# Altium project wulpus_pro_shield.PrjPcb (part 1 of 2)
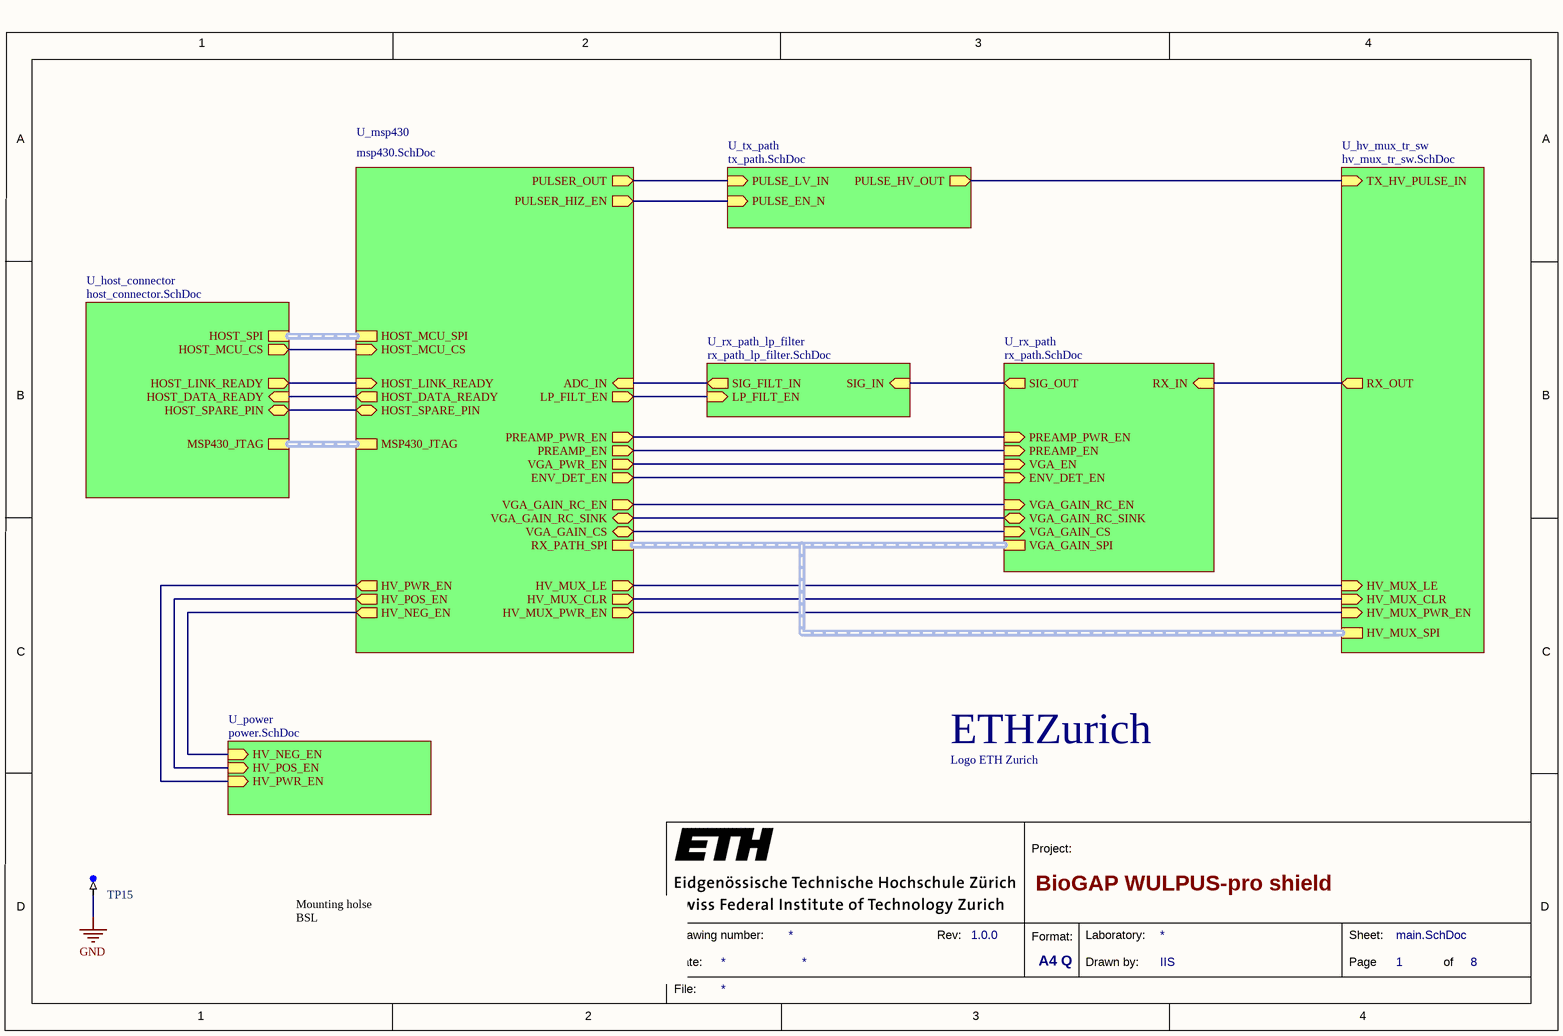
[diagram p0: main.SchDoc]
title: BioGAP WULPUS-pro shield
8 sheets, 187 parts. Net scope: hierarchical (ports join the sheet entries above them; power ports are global).
Board file: wulpus_pro_acq.PcbDoc
Sheets:
  main.SchDoc
    U_rx_path = rx_path.SchDoc
    U_rx_path_lp_filter = rx_path_lp_filter.SchDoc
    U_tx_path = tx_path.SchDoc
    U_hv_mux_tr_sw = hv_mux_tr_sw.SchDoc
    U_msp430 = msp430.SchDoc
    U_host_connector = host_connector.SchDoc
    U_power = power.SchDoc

## Sheet main.SchDoc: BioGAP WULPUS-pro shield
size A4; CompanyName: ETH Zurich; DrawnBy: IIS; Revision: 1.0.0; SheetNumber: 1; SheetTotal: 8

### Parts
A1  Logo ETH Zurich  [eth-zurich_3mm]  (no BOM)
TP15  TP-SM-C-100  [TP-SM-C-100]  (value not drawn)  (no BOM)

### Sub-sheets
U_host_connector = host_connector.SchDoc: HOST_SPI (harness SPI), HOST_MCU_CS (out), HOST_DATA_READY (in), HOST_LINK_READY (out), HOST_SPARE_PIN (bidir), MSP430_JTAG (harness JTAG)
U_hv_mux_tr_sw = hv_mux_tr_sw.SchDoc: HV_MUX_SPI (harness SPI), HV_MUX_LE (in), HV_MUX_CLR (in), RX_OUT (out), HV_MUX_PWR_EN (in), TX_HV_PULSE_IN (in)
U_msp430 = msp430.SchDoc: ADC_IN (in), PULSER_OUT (out), RX_PATH_SPI (harness SPI), HV_MUX_CLR (out), HV_MUX_LE (out), PREAMP_PWR_EN (out), HOST_DATA_READY (out), HV_MUX_PWR_EN (out), HV_POS_EN (out), HV_NEG_EN (out), HV_PWR_EN (out), HOST_MCU_SPI (harness SPI), HOST_LINK_READY (in), VGA_PWR_EN (out), ENV_DET_EN (out), PULSER_HIZ_EN (out), VGA_GAIN_RC_EN (out), VGA_GAIN_RC_SINK (bidir), VGA_GAIN_CS (bidir), PREAMP_EN (out), HOST_MCU_CS (in), HOST_SPARE_PIN (bidir), MSP430_JTAG (harness JTAG), LP_FILT_EN (out)
U_power = power.SchDoc: HV_PWR_EN (in), HV_POS_EN (in), HV_NEG_EN (in)
U_rx_path = rx_path.SchDoc: VGA_GAIN_RC_EN (in), VGA_GAIN_RC_SINK (bidir), RX_IN (in), SIG_OUT (out), VGA_GAIN_SPI (harness SPI), VGA_GAIN_CS (in), ENV_DET_EN (in), VGA_EN (in), PREAMP_EN (in), PREAMP_PWR_EN (in)
U_rx_path_lp_filter = rx_path_lp_filter.SchDoc: LP_FILT_EN (in), SIG_IN (in), SIG_FILT_IN (out)
U_tx_path = tx_path.SchDoc: PULSE_EN_N (in), PULSE_LV_IN (in), PULSE_HV_OUT (out)

### Nets
GND: TP15.1
CH0_OUT: sheet U_tx_path/PULSE_LV_IN, sheet U_msp430/PULSER_OUT
DATA_READY: sheet U_msp430/HOST_DATA_READY, sheet U_host_connector/HOST_DATA_READY
ENV_DET_EN: sheet U_rx_path/ENV_DET_EN, sheet U_msp430/ENV_DET_EN
FILTER_SHDN_N: sheet U_rx_path_lp_filter/LP_FILT_EN, sheet U_msp430/LP_FILT_EN
HOST_LINK_RDY: sheet U_msp430/HOST_LINK_READY, sheet U_host_connector/HOST_LINK_READY
HOST_SPARE: sheet U_msp430/HOST_SPARE_PIN, sheet U_host_connector/HOST_SPARE_PIN
HOST_SPI_CS: sheet U_msp430/HOST_MCU_CS, sheet U_host_connector/HOST_MCU_CS
HV_EN1: sheet U_msp430/HV_POS_EN, sheet U_power/HV_POS_EN
HV_EN2: sheet U_msp430/HV_NEG_EN, sheet U_power/HV_NEG_EN
HV_MUX_CLR: sheet U_hv_mux_tr_sw/HV_MUX_CLR, sheet U_msp430/HV_MUX_CLR
HV_MUX_LE: sheet U_hv_mux_tr_sw/HV_MUX_LE, sheet U_msp430/HV_MUX_LE
HV_MUX_PWR_EN: sheet U_hv_mux_tr_sw/HV_MUX_PWR_EN, sheet U_msp430/HV_MUX_PWR_EN
HV_PWR_EN: sheet U_msp430/HV_PWR_EN, sheet U_power/HV_PWR_EN
PREAMP_EN: sheet U_rx_path/PREAMP_EN, sheet U_msp430/PREAMP_EN
PREAMP_PWR_EN: sheet U_rx_path/PREAMP_PWR_EN, sheet U_msp430/PREAMP_PWR_EN
PULS_HIZ_EN: sheet U_tx_path/PULSE_EN_N, sheet U_msp430/PULSER_HIZ_EN
VGA_GAIN_CS: sheet U_rx_path/VGA_GAIN_CS, sheet U_msp430/VGA_GAIN_CS
VGA_GAIN_RC_EN: sheet U_rx_path/VGA_GAIN_RC_EN, sheet U_msp430/VGA_GAIN_RC_EN
VGA_GAIN_RC_SINK: sheet U_rx_path/VGA_GAIN_RC_SINK, sheet U_msp430/VGA_GAIN_RC_SINK
VGA_PWR_EN: sheet U_rx_path/VGA_EN, sheet U_msp430/VGA_PWR_EN
NetC6_1: sheet U_rx_path/RX_IN, sheet U_hv_mux_tr_sw/RX_OUT
NetC21_2: sheet U_tx_path/PULSE_HV_OUT, sheet U_hv_mux_tr_sw/TX_HV_PULSE_IN
NetC23_2: sheet U_rx_path_lp_filter/SIG_FILT_IN, sheet U_msp430/ADC_IN
NetTP8_1: sheet U_rx_path/SIG_OUT, sheet U_rx_path_lp_filter/SIG_IN

### Buses and harness runs
harness sheet U_host_connector/HOST_SPI = sheet U_msp430/HOST_MCU_SPI
harness sheet U_host_connector/MSP430_JTAG = sheet U_msp430/MSP430_JTAG
harness sheet U_hv_mux_tr_sw/HV_MUX_SPI = sheet U_msp430/RX_PATH_SPI = sheet U_rx_path/VGA_GAIN_SPI

### Notes on the sheet
- Mounting holse
  BSL
- 1
- 2
- 3
- 4
- A
- B
- C
- Project:
- D
- Date:
- Drawing number:
- Rev:
- Format:
- A4 Q
- Drawn by:
- Laboratory:
- Page
- Sheet:
- of
- File:
- (in symbol CMP-00038-1) ETHZurich

### Library data of the parts
A1 = CMP-00038-1
TP15 = CMP-0484-00002-1: Test Point, Surface Mount, Circular, Pad Diameter 1 mm

## Sheet rx_path.SchDoc: BioGAP WULPUS-pro shield
size A3; DrawnBy: IIS; Revision: 1.0.0; SheetNumber: 2; SheetTotal: 8
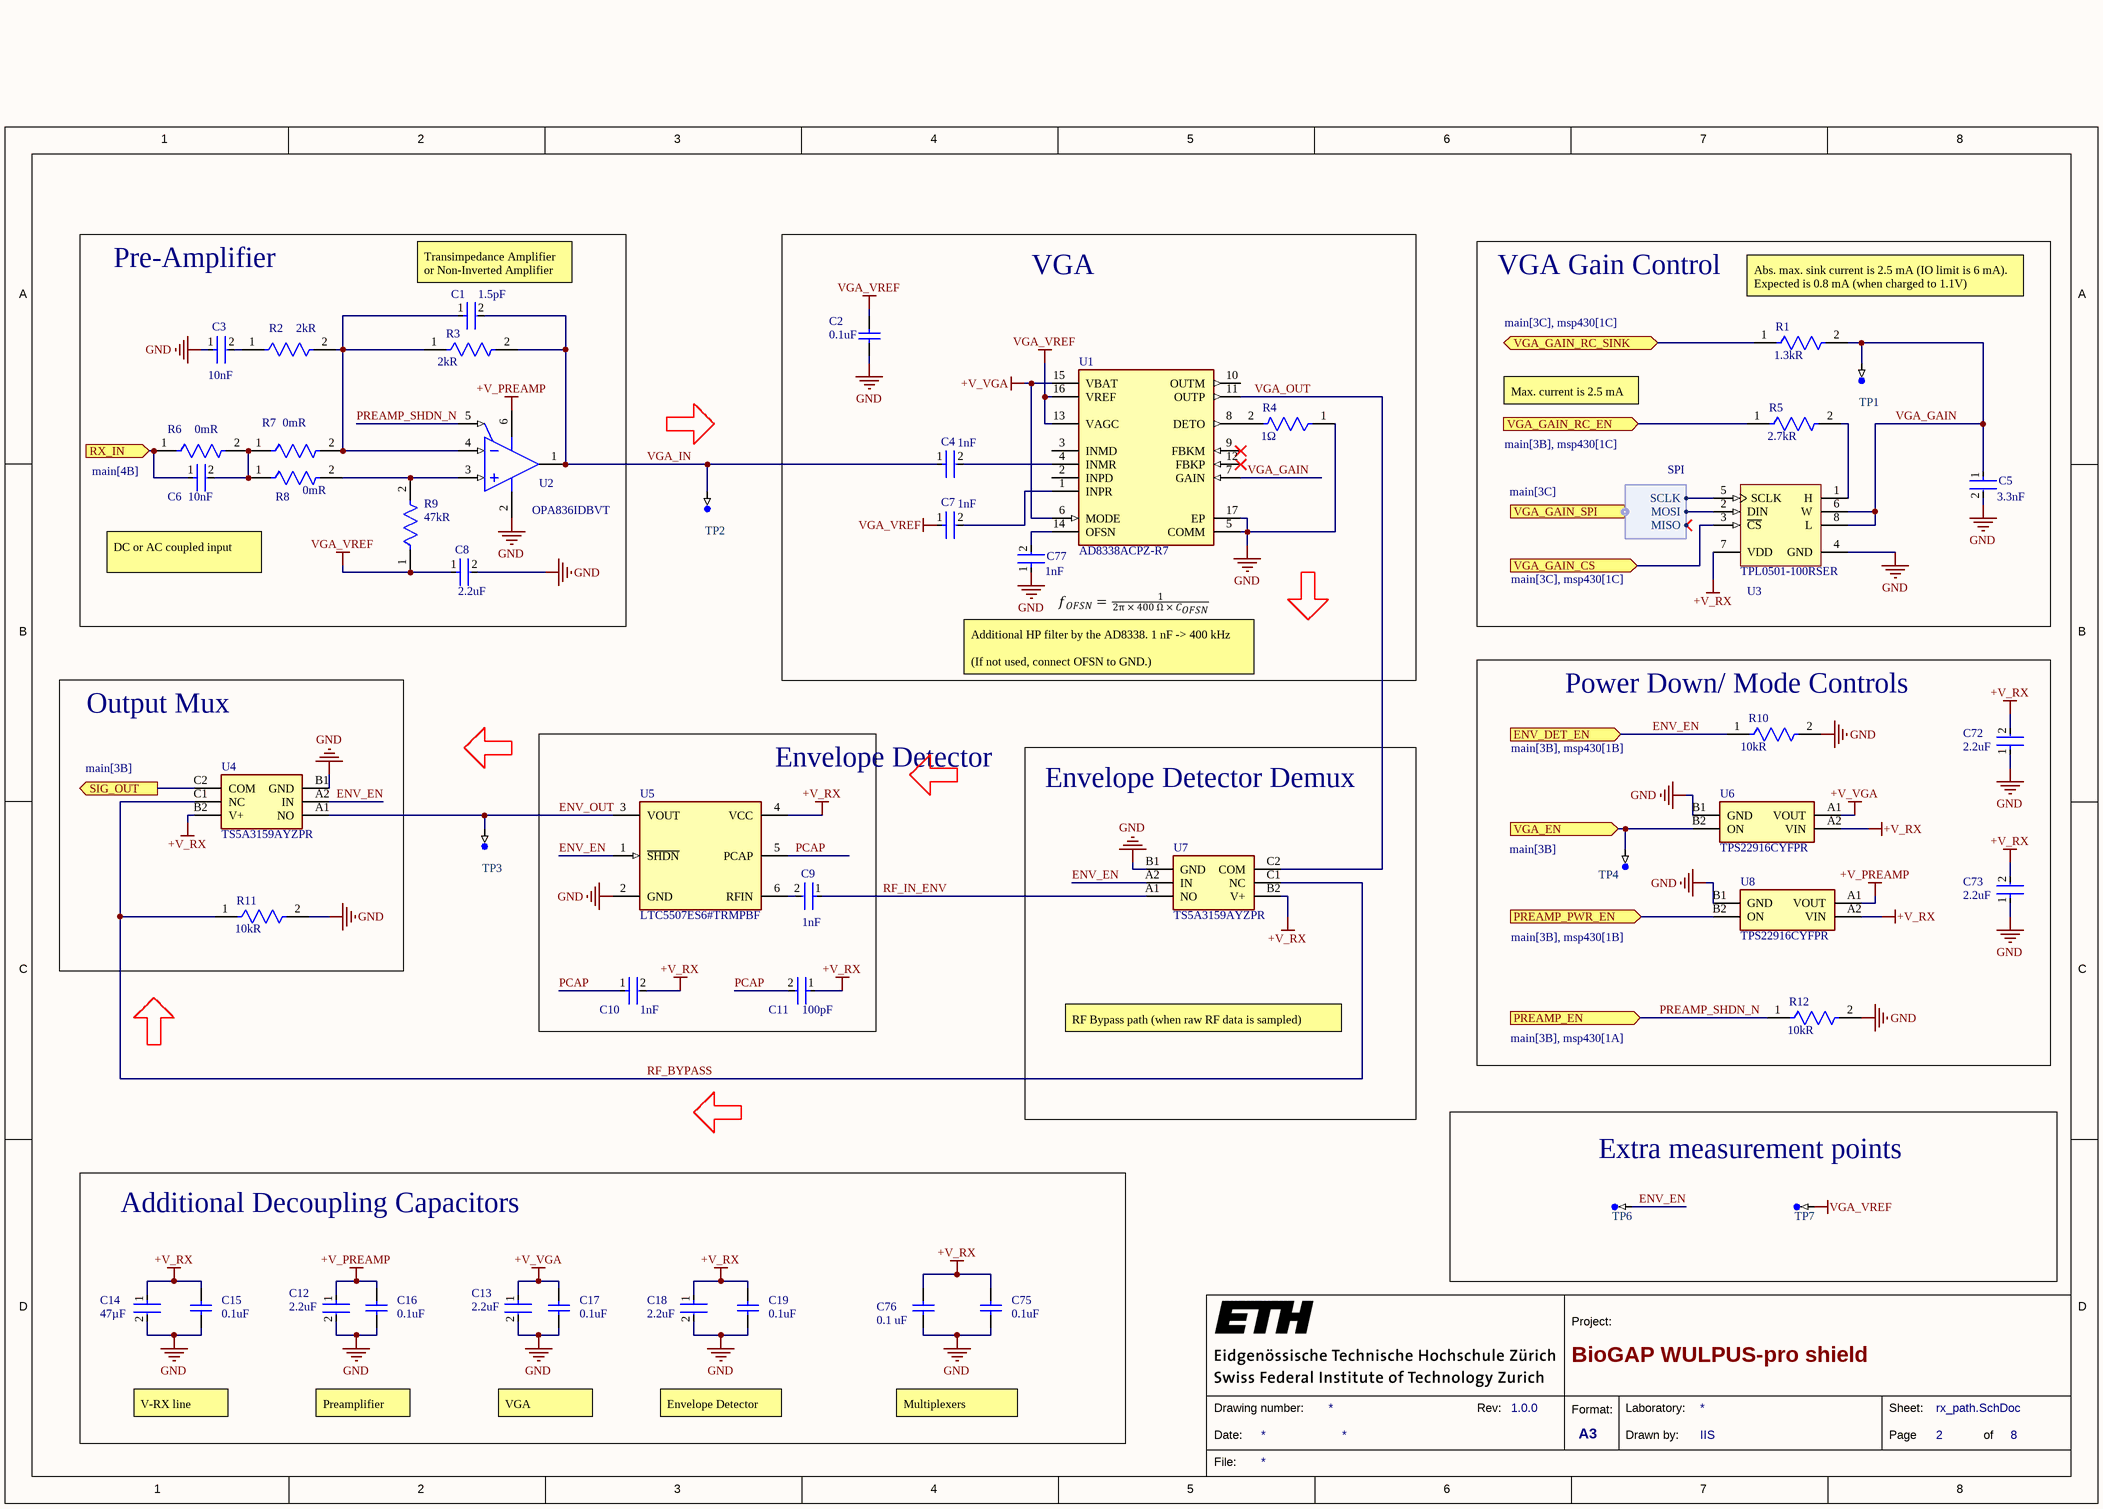
[diagram p1: rx_path.SchDoc]

### Parts
C1  Capacitance: 1.5pF  [FP-GJM155-0_05-IPC_C]  (hidden comment: GJM1555C1H1R5BB01D)
C2  Capacitance: 0.1uF  [CAPC1005X55X30LL05T10]  (hidden comment: C0402C104K4RACTU)
C3  Capacitance: 10nF  [FP-GRM033-0_03-IPC_B]  (hidden comment: GRM033R71A103KA01D)
C4  Capacitance: 1nF  [FP-GRM155-0_05-IPC_B]  (hidden comment: GRM1555C1H102JA01D)
C5  Capacitance: 3.3nF  [FP-0402-L_1_0_1-W_0_5_0_1-IPC_C]  (hidden comment: 04025C332JAT2A)
C6  Capacitance: 10nF  [FP-GRM033-0_03-IPC_B]  (hidden comment: GRM033R71A103KA01D)
C7  Capacitance: 1nF  [FP-GRM155-0_05-IPC_B]  (hidden comment: GRM1555C1H102JA01D)
C8  Capacitance: 2.2uF  [FP-C1005-050-0_15-0_1-MFG]  (hidden comment: C1005X7S1A225K050BC)
C9  Capacitance: 1nF  [FP-GRM155-0_05-IPC_B]  (hidden comment: GRM1555C1H102JA01D)
C10  Capacitance: 1nF  [FP-GRM155-0_05-IPC_B]  (hidden comment: GRM1555C1H102JA01D)
C11  Capacitance: 100pF  [FP-0402-L_1_0_1-W_0_5_0_1-MFG]  (hidden comment: 04025A101FAT2A)
C12  Capacitance: 2.2uF  [FP-C1005-050-0_15-0_1-MFG]  (hidden comment: C1005X7S1A225K050BC)
C13  Capacitance: 2.2uF  [FP-C1005-050-0_15-0_1-MFG]  (hidden comment: C1005X7S1A225K050BC)
C14  Capacitance: 47µF  [FP-GRM188-0_2-MFG]  (hidden comment: GRM188R60J476ME01D)
C15  Capacitance: 0.1uF  [CAPC1005X55X30LL05T10]  (hidden comment: C0402C104K4RACTU)
C16  Capacitance: 0.1uF  [CAPC1005X55X30LL05T10]  (hidden comment: C0402C104K4RACTU)
C17  Capacitance: 0.1uF  [CAPC1005X55X30LL05T10]  (hidden comment: C0402C104K4RACTU)
C18  Capacitance: 2.2uF  [FP-C1005-050-0_15-0_1-MFG]  (hidden comment: C1005X7S1A225K050BC)
C19  Capacitance: 0.1uF  [CAPC1005X55X30LL05T10]  (hidden comment: C0402C104K4RACTU)
C72  Capacitance: 2.2uF  [FP-C1005-050-0_15-0_1-MFG]  (hidden comment: C1005X7S1A225K050BC)
C73  Capacitance: 2.2uF  [FP-C1005-050-0_15-0_1-MFG]  (hidden comment: C1005X7S1A225K050BC)
C75  Capacitance: 0.1uF  [CAPC1005X55X30LL05T10]  (hidden comment: C0402C104K4RACTU)
C76  Capacitance: 0.1 uF  [CAPC1005X55X30LL05T10]  (hidden comment: C0402C104K4RACTU)
C77  Capacitance: 1nF  [FP-GRM155-0_05-IPC_B]  (hidden comment: GRM1555C1H102JA01D)
R1  Resistance: 1.3kR  [FP-CRCW0402-e3-IPC_B]  (hidden comment: CRCW04021K30JNED)
R2  Resistance: 2kR  [FP-ERJ2RK-MFG]  (hidden comment: ERJ-2RKF2001X)
R3  Resistance: 2kR  [FP-ERJ2RK-MFG]  (hidden comment: ERJ-2RKF2001X)
R4  Resistance: 1Ω  [FP-CRCW0402-C-e3-MFG]  (hidden comment: CRCW04021R00FKEDC)
R5  Resistance: 2.7kR  [FP-MCS0402-IPC_B]  (hidden comment: MCS04020C2701FE000)
R6  Resistance: 0mR  [FP-CRCW0402-e3-IPC_C]  (hidden comment: CRCW04020000Z0ED)
R7  Resistance: 0mR  [FP-CRCW0402-e3-IPC_C]  (hidden comment: CRCW04020000Z0ED)
R8  Resistance: 0mR  [FP-CRCW0402-e3-IPC_C]  (hidden comment: CRCW04020000Z0ED)
R9  Resistance: 47kR  [FP-RMCF0201-MFG]  (hidden comment: RMCF0201JT47K0)
R10  Resistance: 10kR  [FP-CRCW0402-e3-IPC_B]  (hidden comment: CRCW040210K0JNED)
R11  Resistance: 10kR  [FP-CRCW0402-e3-IPC_B]  (hidden comment: CRCW040210K0JNED)
R12  Resistance: 10kR  [FP-CRCW0402-e3-IPC_B]  (hidden comment: CRCW040210K0JNED)
TP1  TP-SM-C-100  [TP-SM-C-100]  (value not drawn)  (no BOM)
TP2  TP-SM-C-100  [TP-SM-C-100]  (value not drawn)  (no BOM)
TP3  TP-SM-C-100  [TP-SM-C-100]  (value not drawn)  (no BOM)
TP4  TP-SM-C-100  [TP-SM-C-100]  (value not drawn)  (no BOM)
TP6  TP-SM-C-100  [TP-SM-C-100]  (value not drawn)  (no BOM)
TP7  TP-SM-C-100  [TP-SM-C-100]  (value not drawn)  (no BOM)
U1  AD8338ACPZ-R7  [FP-CP-16-22-IPC_C]
U2  OPA836IDBVT  [DBV0006A_L]
U3  TPL0501-100RSER  [TI-RSE8_V]
U4  TS5A3159AYZPR  [BGA6C50P2X3_89X139X50]
U5  LTC5507ES6#TRMPBF  [FP-LTC5507ES6#TRMPBF-IPC_B]
U6  TPS22916CYFPR  [BGA4C40P2X2_78X78X50]
U7  TS5A3159AYZPR  [BGA6C50P2X3_89X139X50]
U8  TPS22916CYFPR  [BGA4C40P2X2_78X78X50]

### Blocks framed on the sheet
Pre-Amplifier: C1 C3 C6 C8 R2 R3 R6-R9 U2
VGA: C2 C4 C7 C77 R4 U1
VGA Gain Control: C5 R1 R5 TP1 U3
Power Down/ Mode Controls: C72 C73 R10 R12 TP4 U6 U8
Output Mux: R11 U4
Envelope Detector: C9-C11 U5
Envelope Detector Demux: U7
Extra measurement points: TP6 TP7
Additional Decoupling Capacitors: C12-C19 C75 C76

### Ports
ENV_DET_EN (in, see main[3B], msp430[1B]), PREAMP_EN (in, see main[3B], msp430[1A]), PREAMP_PWR_EN (in, see main[3B], msp430[1B]), RX_IN (in, see main[4B]), SIG_OUT (out, see main[3B]), VGA_EN (in, see main[3B]), VGA_GAIN_CS (in, see main[3C], msp430[1C]), VGA_GAIN_RC_EN (in, see main[3B], msp430[1C]), VGA_GAIN_RC_SINK (bidir, see main[3C], msp430[1C]), VGA_GAIN_SPI (harness SPI, see main[3C])

### Harnesses
SPI: SCLK, MOSI, MISO

### Nets
+V_PREAMP: C12.1 C16.2 U2.6(VS+) U8.A1(VOUT)
+V_RX: C10.2 C11.1 C14.1 C15.2 C18.1 C19.2 C72.2 C73.2 C75.2 C76.2 U3.7(VDD) U4.B2(V+) U5.4(VCC) U6.A2(VIN) U7.B2(V+) U8.A2(VIN)
+V_VGA: C13.1 C17.2 U1.6(MODE) U1.15(VBAT) U6.A1(VOUT)
GND: C2.1 C3.1 C5.2 C8.2 C12.2 C13.2 C14.2 C15.1 C16.1 C17.1 C18.2 C19.1 C72.1 C73.1 C75.1 C76.1 C77.1 R4.1 R10.2 R11.2 R12.2 U1.5(COMM) U1.17(EP) U2.2(VS-) U3.4(GND) U4.B1(GND) U5.2(GND) U6.B1(GND) U7.B1(GND) U8.B1(GND)
VGA_VREF: C2.2 C7.1 C8.1 R9.1 TP7.1 U1.13(VAGC) U1.16(VREF)
ENV_EN: R10.1 TP6.1 U4.A2(IN) U5.1(~{SHDN}) U7.A2(IN) ; port ENV_DET_EN  [project net ENV_DET_EN]
ENV_OUT: TP3.1 U4.A1(NO) U5.3(VOUT)
PCAP: C10.1 C11.2 U5.5(PCAP)
PREAMP_PWR_EN: U8.B2(ON) ; port PREAMP_PWR_EN
PREAMP_SHDN_N: R12.1 U2.5(~{PD}) ; port PREAMP_EN  [project net PREAMP_EN]
RF_BYPASS: R11.1 U4.C1(NC) U7.C1(NC)
RF_IN_ENV: C9.1 U7.A1(NO)
RX_SPI_CLK: U3.5(SCLK) ; port VGA_GAIN_SPI.SCLK
RX_SPI_MOSI: U3.2(DIN) ; port VGA_GAIN_SPI.MOSI
VGA_GAIN: C5.1 R1.2 TP1.1 U1.7(GAIN) U3.6(W) U3.8(L)
VGA_GAIN_CS: U3.3(~{CS}) ; port VGA_GAIN_CS
VGA_GAIN_RC_EN: R5.1 ; port VGA_GAIN_RC_EN
VGA_GAIN_RC_SINK: R1.1 ; port VGA_GAIN_RC_SINK
VGA_IN: C1.2 C4.1 R3.2 TP2.1 U2.1(VOUT)
VGA_OUT: U1.11(OUTP) U7.C2(COM)
VGA_PWR_EN: TP4.1 U6.B2(ON) ; port VGA_EN
NetC1_1: C1.1 R2.2 R3.1 R7.2 U2.4(VIN-)
NetC3_2: C3.2 R2.1
NetC4_2: C4.2 U1.4(INMR)
NetC6_1: C6.1 R6.1 ; port RX_IN
NetC6_2: C6.2 R6.2 R7.1 R8.1
NetC7_2: C7.2 U1.1(INPR)
NetC9_2: C9.2 U5.6(RFIN)
NetC77_2: C77.2 U1.14(OFSN)
NetR4_2: R4.2 U1.8(DETO)
NetR5_2: R5.2 U3.1(H)
NetR8_2: R8.2 R9.2 U2.3(VIN+)
NetTP8_1: U4.C2(COM) ; port SIG_OUT

Not connected (* = marked no-connect by the designer): U1 2(INPD) 3(INMD) 9(FBKM)* 10(OUTM) 12(FBKP)*

### Notes on the sheet
- (near C1) Transimpedance Amplifier or Non-Inverted Amplifier
- (near R1) Abs. max. sink current is 2.5 mA (IO limit is 6 mA). Expected is 0.8 mA (when charged to 1.1V)
- Max. current is 2.5 mA
- DC or AC coupled input
- Additional HP filter by the AD8338. 1 nF -> 400 kHz
  (If not used, connect OFSN to GND.)
- RF Bypass path (when raw RF data is sampled)
- V-RX line
- Preamplifier
- VGA
- Envelope Detector
- Multiplexers
- 1
- 2
- 3
- 4
- 5
- 6
- 7
- 8
- A
- B
- C
- D
- Project:
- Date:
- Drawing number:
- Rev:
- Format:
- A3
- Drawn by:
- Laboratory:
- Page
- Sheet:
- of
- File:

### Library data of the parts
C1 = CMP-2008-03820-2: Temperature Coefficient: 30ppm/°C; Voltage Rating: 50V; Dielectric: C0G; Depth: 0.5mm; Case Code (Imperial): 0402; Package Quantity: 10000; Length: 1mm; Number of Pins: 2; Max Operating Temperature: 125°C; Mount: Surface Mount; Construction: Flat; Thickness: 0.022inch; Series: GJM; Packaging: Tape and Reel; Radiation Hardening: No; REACH SVHC: No SVHC; Case/Package: 0402; Lead Free: Lead Free; Voltage Rating (DC): 50V; Min Operating Temperature: -55°C; Termination: SMD/SMT; Width: 0.5mm; Lead Pitch: 0.3mm; Case Code (Metric): 1005; Voltage: 50V; Height: 0.5mm
C2 C15-C17 C19 C75 C76 = CMP-0001-00074-2: Manufacturer: Kemet; Part Number: C0402C104K4RACTU
C3 C6 = CMP-2010-01684-2: Voltage: 10V; Material: Ceramic; Dielectric: X7R; Tolerance: 10%; Package Quantity: 1; Width: 0.012inch; Mount: Surface Mount; Voltage Rating (DC): 10V; Voltage Rating: 10V; Length: 0.6mm; Packaging: Tape and Reel; REACH SVHC: No SVHC; Termination: SMD/SMT; Case/Package: 0201; Radiation Hardening: No; Height: 0.3mm; Case Code (Imperial): 0201; Min Operating Temperature: -55°C; Lead Free: Lead Free; Thickness: 0.013inch; Depth: 0.3mm; Case Code (Metric): 0603; Max Operating Temperature: 125°C
C4 C7 C9 C10 C77 = CMP-2008-04254-2: Tolerance: 5%; Temperature Coefficient: 30ppm/°C; Insulation Resistance: 10GR; Material: Ceramic; Voltage Rating: 50V; Dielectric: C0G; Packaging: Tape and Reel; Lead Free: Lead Free; Thickness: 0.022inch; Termination: SMD/SMT; Max Operating Temperature: 125°C; Height: 0.5mm; Package Quantity: 1; Radiation Hardening: No; Case Code (Metric): 1005; Number of Pins: 2; Mount: Surface Mount; Voltage: 50V; Case/Package: 0402; Min Operating Temperature: -55°C; Dielectric Material: Ceramic; Width: 0.5mm; Depth: 0.5mm; Case Code (Imperial): 0402; REACH SVHC: No SVHC; Voltage Rating (DC): 50V; Length: 1mm
C5 = CMP-2008-02911-2: Dielectric: X7R; Voltage Rating: 50V; Tolerance: 5%; Dissipation Factor: 2.5%; Length: 1mm; Number of Pins: 2; Width: 0.02inch; Case Code (Imperial): 0402; Contact Plating: Tin; Packaging: Tape and Reel; Height: 0.56mm; Case/Package: 0402; Termination: SMD/SMT; Construction: Flat; Max Operating Temperature: 125°C; Min Operating Temperature: -55°C; RoHS Compliant: Yes; Case Code (Metric): 1005; Mount: Surface Mount; Package Quantity: 1; Series: -; REACH SVHC: No SVHC; Lead Free: Lead Free; Voltage Rating (DC): 50V; Radiation Hardening: No; Depth: 0.5mm; Thickness: 0.022inch
C8 C12 C13 C18 C72 C73 = CMP-08246-004344-1: Dielectric: X7S; Dielectric Material: Ceramic; Voltage Rating: 10V; Tolerance: 10%; Mount: Surface Mount; Height: 0.5mm; Package Quantity: 1; Depth: 0.5mm; RoHS Compliant: Yes; Length: 1mm; Thickness: 0.022inch; Packaging: Tape and Reel; Case Code (Imperial): 0402; Resistor Type: Ceramic; Case/Package: 0402; Min Operating Temperature: -55°C; Series: C; Weight: 2.3E-05oz; Width: 0.02inch; Voltage Rating (DC): 10V; Case Code (Metric): 1005; Max Operating Temperature: 125°C; Termination: SMD/SMT; Lead Free: Lead Free
C11 = CMP-2008-02567-2: Dielectric: C0G; Voltage: 50V; Tolerance: 1%; Dielectric Material: Ceramic; Packaging: Tape and Reel; Thickness: 0.022inch; Termination: SMD/SMT; Case Code (Imperial): 0402; Case Code (Metric): 1005; Width: 0.02inch; Radiation Hardening: No; Min Operating Temperature: -55°C; Depth: 0.5mm; Number of Pins: 2; Height: 0.56mm; REACH SVHC: No SVHC; Case/Package: 0402; Voltage Rating: 50V; Length: 1mm; Mount: Surface Mount; Max Operating Temperature: 125°C; Package Quantity: 1; Lead Free: Lead Free; Voltage Rating (DC): 50V
C14 = CMP-00260-117335223-1: Material: Ceramic; Tolerance: 20%; Voltage Rating (DC): 6.3V; Dielectric: X5R; Case/Package: 0603; Width: 800µm; Min Operating Temperature: -55°C; Lifecycle Status: Production; Height: 1mm; Length: 1.6mm; Max Operating Temperature: 85°C; Voltage Rating: 6.3V; NexarPartId: 117335223; Thickness: 800µm
R1 = CMP-1011-00077-3: Tolerance: 5%; Voltage Rating (DC): 50V; Power Rating: 63mW; Temperature Coefficient: 200ppm/°C; Height: 0.016inch; Military Standard: Not; Max Operating Temperature: 155°C; Width: 0.5mm; Features: Automotive AEC-Q200; Depth: 0.5mm; Weight: 2.3E-05oz; Contact Plating: Tin; Case Code (Imperial): 0402; Min Operating Temperature: -55°C; Voltage Rating: 50V; Package Quantity: 1; Lead Free: Lead Free; Case/Package: 0402; Packaging: Tape and Reel; Radiation Hardening: No; Length: 1mm; Case Code (Metric): 1005; Number of Terminations: 2; Max Power Dissipation: 63mW; Composition: Thick Film
R2 R3 = CMP-2002-00758-4: Temperature Coefficient: 100ppm/°C; Max Power Dissipation: 100mW; Working Voltage: 50V; Tolerance: 1%; Number of Terminations: 2; Technology: THICK FILM; Packaging: Tape and Reel; RoHS Compliant: Yes; Min Operating Temperature: -55°C; Length: 1mm; Construction: Rectangular; Features: Automotive AEC-Q200; Contact Plating: Tin; Lead Free: Lead Free; Series: ERJ; Power Rating: 100mW; REACH SVHC: No SVHC; Resistor Type: Thick Film; Max Operating Temperature: 155°C; Package Quantity: 10000; Height: 0.35mm; Case/Package: 0402; Mount: Surface Mount; Termination: SMD/SMT; Resistance Tolerance: 1%; Depth: 0.5mm; Voltage Rating (DC): 50V; Voltage Rating: 50V; Case Code (Imperial): 0402; Military Standard: Not; Width: 0.02inch; Radiation Hardening: No; Case Code (Metric): 1005
R4 = CMP-00030-23798141-1: Tolerance: 1%; Temperature Coefficient: 100ppm/°C; Voltage Rating: 50V; Power Rating: 63mW; Lead Free: Lead Free; Case/Package: 0402; Max Operating Temperature: 155°C; RoHS: Compliant; Height: 350µm; Schedule B: 8533210045, 8533210045; Composition: Thick Film; NexarPartId: 23798141; Min Operating Temperature: -55°C
R5 = CMP-02407-008611-1: Tolerance: 1%; Temperature Coefficient: 50ppm/°C; Max Power Dissipation: 100mW; Number of Terminations: 2; Packaging: Tape and Reel; Package Quantity: 10000; Height: 0.015inch; Length: 0.039inch; Max Operating Temperature: 125°C; Military Standard: Not; Min Operating Temperature: -55°C; Composition: Thin Film; Width: 0.02inch; Depth: 0.5mm; Contact Plating: Tin; Radiation Hardening: No; Case/Package: 0402; Lead Free: Lead Free
R6-R8 = CMP-2002-08122-2: Tolerance: 5%; Max Power Dissipation: 63mW; Voltage Rating: 50V; Temperature Coefficient: 100ppm/°C; Contact Plating: Tin; Height: 0.35mm; Radiation Hardening: No; Features: Automotive AEC-Q200; Composition: Thick Film; Width: 0.5mm; Weight: 2.3E-05oz; Termination: SMD/SMT; Packaging: Tape and Reel; Mount: Surface Mount; Case Code (Metric): 1005; Military Standard: Not; Min Operating Temperature: -55°C; Number of Terminations: 2; Package Quantity: 1; Case Code (Imperial): 0402; Depth: 0.5mm; Max Operating Temperature: 155°C; Case/Package: 0402; Power Rating: 63mW; Lead Free: Lead Free; Voltage Rating (DC): 50V; Length: 1mm
R9 = CMP-26527-004787-1: Power Rating: 50mW; Tolerance: 5%; Temperature Coefficient: 200ppm/°C; Length: 0.024inch; RoHS Compliant: Yes; Max Operating Temperature: 125°C; Width: 0.012inch; Case Code (Metric): 0603; Height: 0.009inch; Case Code (Imperial): 0201; Mount: Surface Mount; Case/Package: 0201; Radiation Hardening: No; Number of Terminations: 2; Min Operating Temperature: -55°C; Series: RMCF; Contact Plating: Tin; Package Quantity: 10000; Packaging: Tape and Reel; Max Power Dissipation: 50mW; Resistor Type: Thick Film
R10-R12 = CMP-2002-08136-3: Temperature Coefficient: 200ppm/°C; Voltage Rating: 50V; Power Rating: 63mW; Tolerance: 5%; Military Standard: Not; Packaging: Tape and Reel; Case Code (Imperial): 0402; Min Operating Temperature: -55°C; Case Code (Metric): 1005; Case/Package: 0402; Termination: SMD/SMT; Composition: Thick Film; Depth: 0.5mm; Number of Terminations: 2; Contact Plating: Tin; Height: 0.016inch; Width: 0.5mm; Max Operating Temperature: 155°C; Features: Automotive AEC-Q200; Length: 1mm; Radiation Hardening: No; Max Power Dissipation: 63mW; Mount: Surface Mount; Package Quantity: 1; Weight: 2.3E-05oz
TP1-TP4 TP6 TP7 = CMP-0484-00002-1: as TP15 on sheet main
U1 = CMP-09116-000032-1: IC OPAMP VGA 1 CIRCUIT 16LFCSP; Manufacturer: Analog Devices; Nominal Supply Current: 3-6mA; Max Supply Voltage: 5V; Number Of Channels: 1; Output Current Per Channel: 5mA; Max Junction Temp: +150°C; Min Supply Voltage: 3V; Bandwidth: 18MHz; Voltage Gain: 80dB; Mouser Description: Special Purpose Amplifiers Ultra Low Pwr 18MHz SGL CH VGA; Device Class L2: Linear ICs; Ipc Land Pattern Name: QFN50P300X300X75-16; Temperature Range Low: -40°C; Device Class L1: Integrated Circuits (ICs); RoHS: TRUE; Digikey Description: IC OPAMP VGA 1 CIRCUIT 16LFCSP; Category: IC; ComponentLink2URL: https://www.analog.com/media/en/technical-documentation/data-sheets/AD8338.pdf; Automotive: No; Height: 0.8mm; Manufacturer Part Number: AD8338ACPZ-R7; Octopart: https://octopart.com/ad8338acpz-r7-analog+devices-21054770; Temperature: -40°C to +85°C; ComponentLink2Description: Datasheet; Lead Free: Yes; Temperature Range High: +85°C; Package: CP-16-22; Device Class L3: Amplifiers - Op Amps
U2 = CMP-0018-00480-2: Very Low Power, Rail to Rail Out, Negative Rail In, VFB Operational Amplifier, 2.5 to 5.5 V, -40 to 125 degC, 6-pin SOT23 (DBV6), Green (RoHS & no Sb/Br); Manufacturer: Texas Instruments; Iq per channel(Max)(mA): 1; Settling Time (0.1%)(Typ)(ns): 30; Vs(Min)(V): 2.5; Vio(Max)(mV): 0.4; 3rd Harmonic(dBc): 105; BW @ Acl(MHz): 205; Vs(Max)(V): 5.5; 2nd Harmonic(dBc): 85; Sub Family: Audio Operational Amplifier, High Output Current Amplifier (>=50mA), High Speed Amplifier (>=50MHz), Low Noise Amp (<=10nV/rtHz), Low Offset Voltage Amplifier (<=500uV), Low Supply Voltage Amplifier (<=2.7V); Vn at Flatband(Typ)(nV/rtHz): 4.6; Iib(Max)(nA): 1000; Slew Rate(Typ)(V/us): 560; Io(Typ)(mA): 50; Number of Channels: 1; Eco-Plan: Green (RoHS & no Sb/Br); PartNumber: OPA836IDBVT; ComponentLink3URL: http://www.ti.com/litv/pdf/mpds026h; ComponentLink3Description: Package Specification; @ MHz: 1; ComponentLink1Description: Manufacturer URL; ComponentLink2URL: http://www.ti.com/general/docs/lit/getliterature.tsp?genericPartNumber=OPA836&fileType=pdf; Acl, min stable gain(V/V): 1; PackageVersion: 4073253-5/K, 03/2006; PackageDescription: 6-Pin Plastic Small Outline, Body 1.6 x 2.9 mm, Pitch 0.95 mm; ComponentLink1URL: http://www.ti.com/; ComponentLink2Description: Datasheet; PackageReference: DBV0006A; Code_JEDEC: MO-178; DatasheetVersion: SLOS712D; Mounting Technology: Surface Mount
U3 = CMP-0004-01511-1: 256-Tap, 100 k, Single Channel Potentiometer with SPI Interface, -40 to 125 degC, 8-pin QFN (RSE8), Green (RoHS & no Sb/Br); Manufacturer: Texas Instruments; Settling Time(us): 3; SubFamily: Digital Potentiometer; DNL(Max)(+/-LSB): 0.5; DAC Channels: 1; PackageVersion: 4207268-2/D, 01/2011; PackageDescription: 8-Pin Plastic Quad Flatpack No-Pin, 1.5 x 1.5 mm Body, 0.5 mm Pitch; ComponentLink3Description: Package Specification; ComponentLink3URL: http://www.ti.com/litv/pdf/mpqf207b; ComponentLink2Description: Datasheet; INL(Max)(+/-LSB): 1; ComponentLink2URL: http://www.ti.com/general/docs/lit/getliterature.tsp?genericPartNumber=TPL0501-100&fileType=pdf; DatasheetVersion: SLIS136A; PackageReference: RSE8; Eco-Plan: Green (RoHS & no Sb/Br); ComponentLink1URL: http://www.ti.com/; PartNumber: TPL0501-100RSER; ComponentLink1Description: Manufacturer URL; Interface: SPI; Code_JEDEC: MO-288; Mounting Technology: Surface Mount
U4 U7 = TS5A3159AYZPR: Analogue Switch ICs SPDT ANALOG SWITCH; Manufacturer_Name: Texas Instruments; Geometry.Height: 0.5mm; Manufacturer_Part_Number: TS5A3159AYZPR; Arrow Part Number: TS5A3159AYZPR; Arrow Price/Stock: https://www.arrow.com/en/products/ts5a3159ayzpr/texas-instruments?utm_currency=USD&region=nac; Datasheet Link: https://www.ti.com/lit/ds/symlink/ts5a3159a.pdf?ts=1623385377964&ref_url=https%253A%252F%252Fwww.ti.com%252Fproduct%252FTS5A3159A
U5 = CMP-09141-000004-1: IC RF DETECT 100KHZ-1GHZ TSOT23; Manufacturer: Analog Devices; Standoff Height: 0.01mm; Max Junction Temp: +125°C; Max Frequency: 1000MHz; Bandwidth: 999.9MHz; Temperature Range Low: -40°C; ComponentLink2URL: https://www.analog.com/media/en/technical-documentation/data-sheets/5507f.pdf; Automotive: No; Device Class L2: RF Semiconductors and Devices; Height: 1mm; RoHS: TRUE; Mouser Description: RF Detector 0.1MHz to 1000MHz 14dBm Automotive 6-Pin TSOT-23 T/R; Lead Free: Yes; Temperature Range High: +85°C; Device Class L3: unset; Category: IC; Octopart: https://octopart.com/ltc5507es6%23trmpbf-analog+devices-88320008; Digikey Description: IC RF DETECT 100KHZ-1GHZ TSOT23; Package: TSOT-23; Temperature: -40°C to +85°C; ComponentLink2Description: Datasheet; Device Class L1: Integrated Circuits (ICs); Manufacturer Part Number: LTC5507ES6#TRMPBF; Ipc Land Pattern Name: SOT95P280X91-6
U6 U8 = TPS22916CYFPR: TPS22916 5.5-V, 2-A Ultra-Low Leakage Load Switch; Manufacturer_Name: Texas Instruments; Geometry.Height: 0.5mm; Manufacturer_Part_Number: TPS22916CYFPR; Arrow Part Number: TPS22916CYFPR; Arrow Price/Stock: https://www.arrow.com/en/products/tps22916cyfpr/texas-instruments?utm_currency=USD&region=nac; Datasheet Link: http://www.ti.com/lit/gpn/tps22916

## Sheet rx_path_lp_filter.SchDoc: BioGAP WULPUS-pro shield
size A4; DrawnBy: IIS; Revision: 1.0.0; SheetNumber: 4; SheetTotal: 8
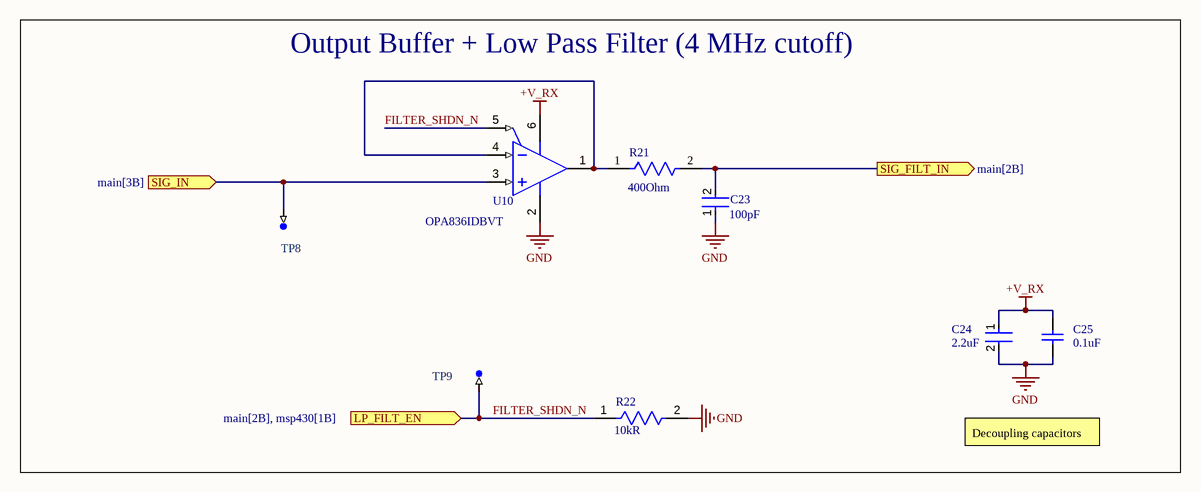
[diagram p2: rx_path_lp_filter.SchDoc]

### Parts
C23  Capacitance: 100pF  [FP-0402-L_1_0_1-W_0_5_0_1-MFG]  (hidden comment: 04025A101FAT2A)
C24  Capacitance: 2.2uF  [FP-C1005-050-0_15-0_1-MFG]  (hidden comment: C1005X7S1A225K050BC)
C25  Capacitance: 0.1uF  [CAPC1005X55X30LL05T10]  (hidden comment: C0402C104K4RACTU)
R21  Resistance: 400Ohm  [FP-CRCW0402-C-e3-MFG]  (hidden comment: CRCW0402402RFKEDC)
R22  Resistance: 10kR  [FP-CRCW0402-e3-IPC_B]  (hidden comment: CRCW040210K0JNED)
TP8  TP-SM-C-100  [TP-SM-C-100]  (value not drawn)  (no BOM)
TP9  TP-SM-C-100  [TP-SM-C-100]  (value not drawn)  (no BOM)
U10  OPA836IDBVT  [DBV0006A_L]

### Blocks framed on the sheet
Output Buffer + Low Pass Filter (4 MHz cutoff): C23-C25 R21 R22 TP8 TP9 U10

### Ports
LP_FILT_EN (in, see main[2B], msp430[1B]), SIG_FILT_IN (out, see main[2B]), SIG_IN (in, see main[3B])

### Nets
+V_RX: C24.1 C25.2 U10.6(VS+)
GND: C23.1 C24.2 C25.1 R22.2 U10.2(VS-)
FILTER_SHDN_N: R22.1 TP9.1 U10.5(~{PD}) ; port LP_FILT_EN
NetC23_2: C23.2 R21.2 ; port SIG_FILT_IN
NetR21_1: R21.1 U10.1(VOUT) U10.4(VIN-)
NetTP8_1: TP8.1 U10.3(VIN+) ; port SIG_IN

### Notes on the sheet
- Decoupling capacitors
- 1
- 2
- 3
- 4
- A
- B
- C
- Project:
- D
- Date:
- Drawing number:
- Rev:
- Format:
- A4 Q
- Drawn by:
- Laboratory:
- Page
- Sheet:
- of
- File:

### Library data of the parts
C23 = CMP-2008-02567-2: as C11 on sheet rx_path; Packaging: Tape and Reel; Thickness: 0.022inch; Termination: SMD/SMT; Case Code (Imperial): 0402; Case Code (Metric): 1005; Width: 0.02inch; Radiation Hardening: No; Min Operating Temperature: -55°C; Depth: 0.5mm; Number of Pins: 2; Height: 0.56mm; REACH SVHC: No SVHC; Case/Package: 0402; Voltage Rating: 50V; Length: 1mm; Mount: Surface Mount; Max Operating Temperature: 125°C; Package Quantity: 1; Lead Free: Lead Free; Voltage Rating (DC): 50V
C24 = CMP-08246-004344-1: as C8 on sheet rx_path; Mount: Surface Mount; Height: 0.5mm; Package Quantity: 1; Depth: 0.5mm; RoHS Compliant: Yes; Length: 1mm; Thickness: 0.022inch; Packaging: Tape and Reel; Case Code (Imperial): 0402; Resistor Type: Ceramic; Case/Package: 0402; Min Operating Temperature: -55°C; Series: C; Weight: 2.3E-05oz; Width: 0.02inch; Voltage Rating (DC): 10V; Case Code (Metric): 1005; Max Operating Temperature: 125°C; Termination: SMD/SMT; Lead Free: Lead Free
C25 = CMP-0001-00074-2: Manufacturer: Kemet; Part Number: C0402C104K4RACTU
R21 = CMP-00030-23798141-1: as R4 on sheet rx_path; Lead Free: Lead Free; Case/Package: 0402; Max Operating Temperature: 155°C; RoHS: Compliant; Height: 350µm; Schedule B: 8533210045, 8533210045; Composition: Thick Film; NexarPartId: 23798141; Min Operating Temperature: -55°C
R22 = CMP-2002-08136-3: as R10 on sheet rx_path; Military Standard: Not; Packaging: Tape and Reel; Case Code (Imperial): 0402; Min Operating Temperature: -55°C; Case Code (Metric): 1005; Case/Package: 0402; Termination: SMD/SMT; Composition: Thick Film; Depth: 0.5mm; Number of Terminations: 2; Contact Plating: Tin; Height: 0.016inch; Width: 0.5mm; Max Operating Temperature: 155°C; Features: Automotive AEC-Q200; Length: 1mm; Radiation Hardening: No; Max Power Dissipation: 63mW; Mount: Surface Mount; Package Quantity: 1; Weight: 2.3E-05oz
TP8 TP9 = CMP-0484-00002-1: as TP15 on sheet main
U10 = CMP-0018-00480-2: as U2 on sheet rx_path; Number of Channels: 1; Eco-Plan: Green (RoHS & no Sb/Br); PartNumber: OPA836IDBVT; ComponentLink3URL: http://www.ti.com/litv/pdf/mpds026h; ComponentLink3Description: Package Specification; @ MHz: 1; ComponentLink1Description: Manufacturer URL; ComponentLink2URL: http://www.ti.com/general/docs/lit/getliterature.tsp?genericPartNumber=OPA836&fileType=pdf; Acl, min stable gain(V/V): 1; PackageVersion: 4073253-5/K, 03/2006; PackageDescription: 6-Pin Plastic Small Outline, Body 1.6 x 2.9 mm, Pitch 0.95 mm; ComponentLink1URL: http://www.ti.com/; ComponentLink2Description: Datasheet; PackageReference: DBV0006A; Code_JEDEC: MO-178; DatasheetVersion: SLOS712D; Mounting Technology: Surface Mount

## Sheet tx_path.SchDoc: BioGAP WULPUS-pro shield
size A4; DrawnBy: IIS; Revision: 1.0.0; SheetNumber: 3; SheetTotal: 8
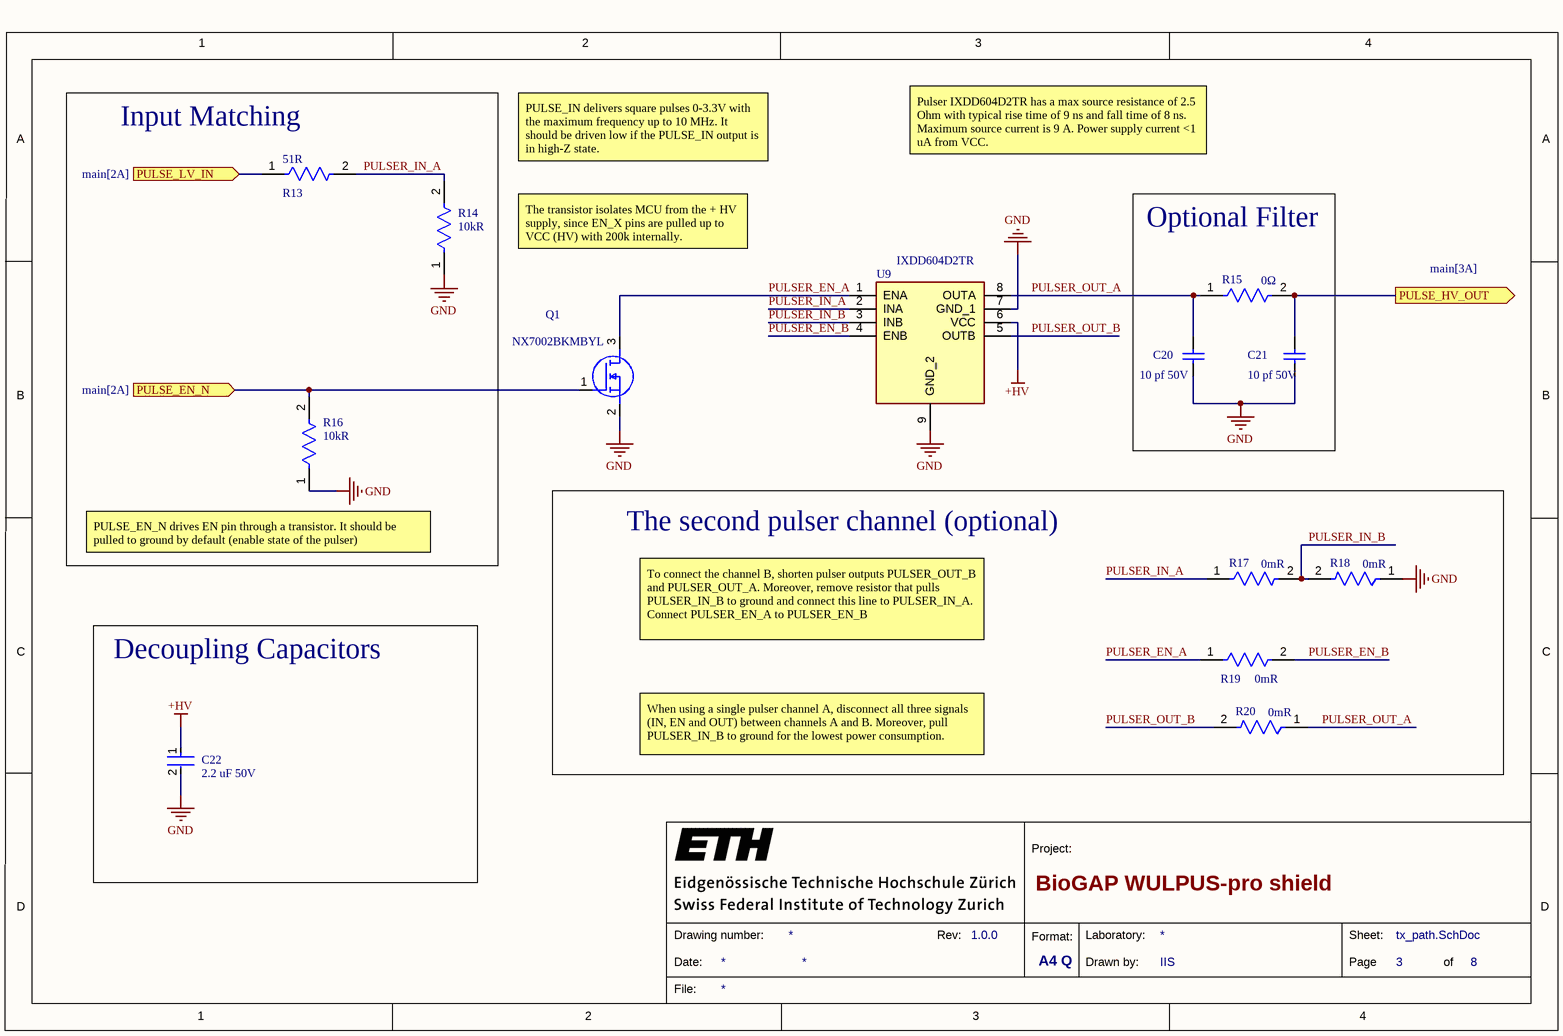
[diagram p3: tx_path.SchDoc]

### Parts
C20  Capacitance: 10 pf 50V  [CAPC1005X55X25LL05T10]  (hidden comment: GRM1555C1H100JA01D)
C21  Capacitance: 10 pf 50V  [CAPC1005X55X25LL05T10]  (hidden comment: GRM1555C1H100JA01D)
C22  Capacitance: 2.2 uF 50V  [FP-GRM188-0_2-IPC_B]  (hidden comment: GRM188R61H225ME11D)
Q1  NX7002BKMBYL  [NX7002BKMBYL]
R13  Resistance: 51R  [FP-CRCW0402-e3-IPC_C]  (hidden comment: CRCW040251R0JNED)
R14  Resistance: 10kR  [FP-CRCW0402-e3-IPC_B]  (hidden comment: CRCW040210K0JNED)
R15  value 0Ω  [FP-ERJ-3GEY0R00V-MFG]  (hidden comment: ERJ-3GEY0R00V)
R16  Resistance: 10kR  [FP-CRCW0402-e3-IPC_B]  (hidden comment: CRCW040210K0JNED)
R17  Resistance: 0mR  [FP-CRCW0402-e3-IPC_C]  (hidden comment: CRCW04020000Z0ED)
R18  Resistance: 0mR  [FP-CRCW0402-e3-IPC_C]  (hidden comment: CRCW04020000Z0ED)
R19  Resistance: 0mR  [FP-CRCW0402-e3-IPC_C]  (hidden comment: CRCW04020000Z0ED)
R20  Resistance: 0mR  [FP-CRCW0402-e3-IPC_C]  (hidden comment: CRCW04020000Z0ED)
U9  IXDD604D2TR  [SON95P500X400X100-9N]

### Blocks framed on the sheet
Input Matching: R13 R14 R16
Optional Filter: C20 C21 R15
The second pulser channel (optional): R17-R20
Decoupling Capacitors: C22

### Ports
PULSE_EN_N (in, see main[2A]), PULSE_HV_OUT (out, see main[3A]), PULSE_LV_IN (in, see main[2A])

### Nets
+HV: C22.1 U9.6(VCC)
GND: C20.1 C21.1 C22.2 Q1.2(S) R14.1 R16.1 R18.1 U9.7(GND_1) U9.9(GND_2)
CH0_OUT: R13.1 ; port PULSE_LV_IN
PULS_HIZ_EN: Q1.1(G) R16.2 ; port PULSE_EN_N
PULSER_EN_A: Q1.3(D) R19.1 U9.1(ENA)
PULSER_EN_B: R19.2 U9.4(ENB)
PULSER_IN_A: R13.2 R14.2 R17.1 U9.2(INA)
PULSER_IN_B: R17.2 R18.2 U9.3(INB)
PULSER_OUT_A: C20.2 R15.1 R20.1 U9.8(OUTA)
PULSER_OUT_B: R20.2 U9.5(OUTB)
NetC21_2: C21.2 R15.2 ; port PULSE_HV_OUT

### Notes on the sheet
- PULSE_IN delivers square pulses 0-3.3V with the maximum frequency up to 10 MHz. It should be driven low if the PULSE_IN output is in high-Z state.
- Pulser IXDD604D2TR has a max source resistance of 2.5 Ohm with typical rise time of 9 ns and fall time of 8 ns. Maximum source current is 9 A. Power supply current <1 uA from VCC.
- The transistor isolates MCU from the + HV supply, since EN_X pins are pulled up to VCC (HV) with 200k internally.
- (near R16) PULSE_EN_N drives EN pin through a transistor. It should be pulled to ground by default (enable state of the pulser)
- To connect the channel B, shorten pulser outputs PULSER_OUT_B and PULSER_OUT_A. Moreover, remove resistor that pulls PULSER_IN_B to ground and connect this line to PULSER_IN_A. Connect PULSER_EN_A to PULSER_EN_B
- When using a single pulser channel A, disconnect all three signals (IN, EN and OUT) between channels A and B. Moreover, pull PULSER_IN_B to ground for the lowest power consumption.
- 1
- 2
- 3
- 4
- A
- B
- C
- Project:
- D
- Date:
- Drawing number:
- Rev:
- Format:
- A4 Q
- Drawn by:
- Laboratory:
- Page
- Sheet:
- of
- File:

### Library data of the parts
C20 C21 = CMP-2008-04245-1: Manufacturer: Murata; Part Number: GRM1555C1H100JA01D
C22 = CMP-06035-000704-1: Voltage Rating (DC): 50V; Dielectric: X5R; Tolerance: 20%; Weight: 0.000222oz; Min Operating Temperature: -55°C; Case Code (Imperial): 0603; Thickness: 0.039inch; Height: 0.8mm; Termination: SMD/SMT; Resistor Type: Ceramic; Case/Package: 0603; Package Quantity: 4000; Length: 0.063inch; Lead Free: Lead Free; Max Operating Temperature: 85°C; Packaging: Tape and Reel; Width: 0.031inch; Voltage Rating: 50V; Mount: Surface Mount; Case Code (Metric): 1608
Q1 = NX7002BKMBYL: MOSFET (N-Channel); Manufacturer_Name: Nexperia; Datasheet Link: https://assets.nexperia.com/documents/data-sheet/NX7002BKMB.pdf; Height: 0.4mm; Manufacturer_Part_Number: NX7002BKMBYL; Mouser Part Number: 771-NX7002BKMBYL; Mouser Price/Stock: https://www.mouser.co.uk/ProductDetail/Nexperia/NX7002BKMBYL?qs=%252BRKXB2WKlSdBDdfwQeVqTQ%3D%3D; Arrow Part Number: NX7002BKMBYL; Arrow Price/Stock: https://www.arrow.com/en/products/nx7002bkmbyl/nexperia?region=nac
R13 = CMP-2002-00083-2: Max Power Dissipation: 63mW; Temperature Coefficient: 200ppm/°C; Tolerance: 5%; Voltage Rating: 50V; Depth: 0.5mm; Mount: Surface Mount; Number of Terminations: 2; Height: 0.35mm; Length: 1mm; Case Code (Metric): 1005; Radiation Hardening: No; Min Operating Temperature: -55°C; Termination: SMD/SMT; Military Standard: Not; Lead Free: Lead Free; Power Rating: 63mW; Max Operating Temperature: 155°C; Width: 0.5mm; Features: Automotive AEC-Q200; Weight: 2.3E-05oz; Case Code (Imperial): 0402; Package Quantity: 1; Number of Pins: 2; Case/Package: 0402; Contact Plating: Tin; Voltage Rating (DC): 50V; Packaging: Tape and Reel; Composition: Thick Film
R14 R16 = CMP-2002-08136-3: as R10 on sheet rx_path; Military Standard: Not; Packaging: Tape and Reel; Case Code (Imperial): 0402; Min Operating Temperature: -55°C; Case Code (Metric): 1005; Case/Package: 0402; Termination: SMD/SMT; Composition: Thick Film; Depth: 0.5mm; Number of Terminations: 2; Contact Plating: Tin; Height: 0.016inch; Width: 0.5mm; Max Operating Temperature: 155°C; Features: Automotive AEC-Q200; Length: 1mm; Radiation Hardening: No; Max Power Dissipation: 63mW; Mount: Surface Mount; Package Quantity: 1; Weight: 2.3E-05oz
R15 = CMP-2000-00700-2: Manufacturer: Panasonic; Tolerance: 5%; Automotive Grade: Grade 0; Voltage Rating: 75V; Temperature Coefficient: -100/+600ppm/°C; Power Rating: 0.1W; Mouser Description: Resistor, Chip Thick Film, 0 Ohm, 0.1w, Resistor, Chip Thick Film, 0 Ohm, 0.1w, 5%; Manufacturer Part Number: ERJ-3GEY0R00V; Ipc Land Pattern Name: RESC16080X45; Category: Res; Package: 0603; Temperature: -55°C to +155°C; Temperature Range Low: -55°C; Series: ERJ; Resistance: 0Ω; RoHS: TRUE; Composition: Thick Film; Octopart: https://octopart.com/erj-3gey0r00v-panasonic-55389238; Device Class L1: Passive Components; Footprint Url: https://industrial.panasonic.com/cdbs/www-data/pdf/RDA0000/DMA0000COL17.pdf; ComponentLink2Description: Datasheet; Device Class L2: Resistors; Temperature Range High: +155°C; Digikey Description: RES SMD 0 OHM JUMPER 1/10W 0603; Lead Free: Yes; Device Class L3: Chip SMD Resistors; Height: 0.55mm; ComponentLink2URL: https://industrial.panasonic.com/cdbs/www-data/pdf/RDA0000/AOA0000C301.pdf; Automotive: Yes
R17-R20 = CMP-2002-08122-2: as R6 on sheet rx_path; Contact Plating: Tin; Height: 0.35mm; Radiation Hardening: No; Features: Automotive AEC-Q200; Composition: Thick Film; Width: 0.5mm; Weight: 2.3E-05oz; Termination: SMD/SMT; Packaging: Tape and Reel; Mount: Surface Mount; Case Code (Metric): 1005; Military Standard: Not; Min Operating Temperature: -55°C; Number of Terminations: 2; Package Quantity: 1; Case Code (Imperial): 0402; Depth: 0.5mm; Max Operating Temperature: 155°C; Case/Package: 0402; Power Rating: 63mW; Lead Free: Lead Free; Voltage Rating (DC): 50V; Length: 1mm
U9 = IXDD604D2TR: Integrated Circuit; Manufacturer_Name: LITTELFUSE; Datasheet Link: http://www.ixysic.com/home/pdfs.nsf/www/IXD_604.pdf/$file/IXD_604.pdf; Height: 1mm; Manufacturer_Part_Number: IXDD604D2TR; Mouser Part Number: 849-IXDD604D2TR; Mouser Price/Stock: https://www.mouser.co.uk/ProductDetail/IXYS-Integrated-Circuits/IXDD604D2TR?qs=RF%252Bx3zajg8LeQlBgW9OO7w%3D%3D; Arrow Part Number: IXDD604D2TR; Arrow Price/Stock: https://www.arrow.com/en/products/ixdd604d2tr/ixys